# Altium schematic sheet Sheet1.SchDoc
size A4; SheetNumber: 1; SheetTotal: 1
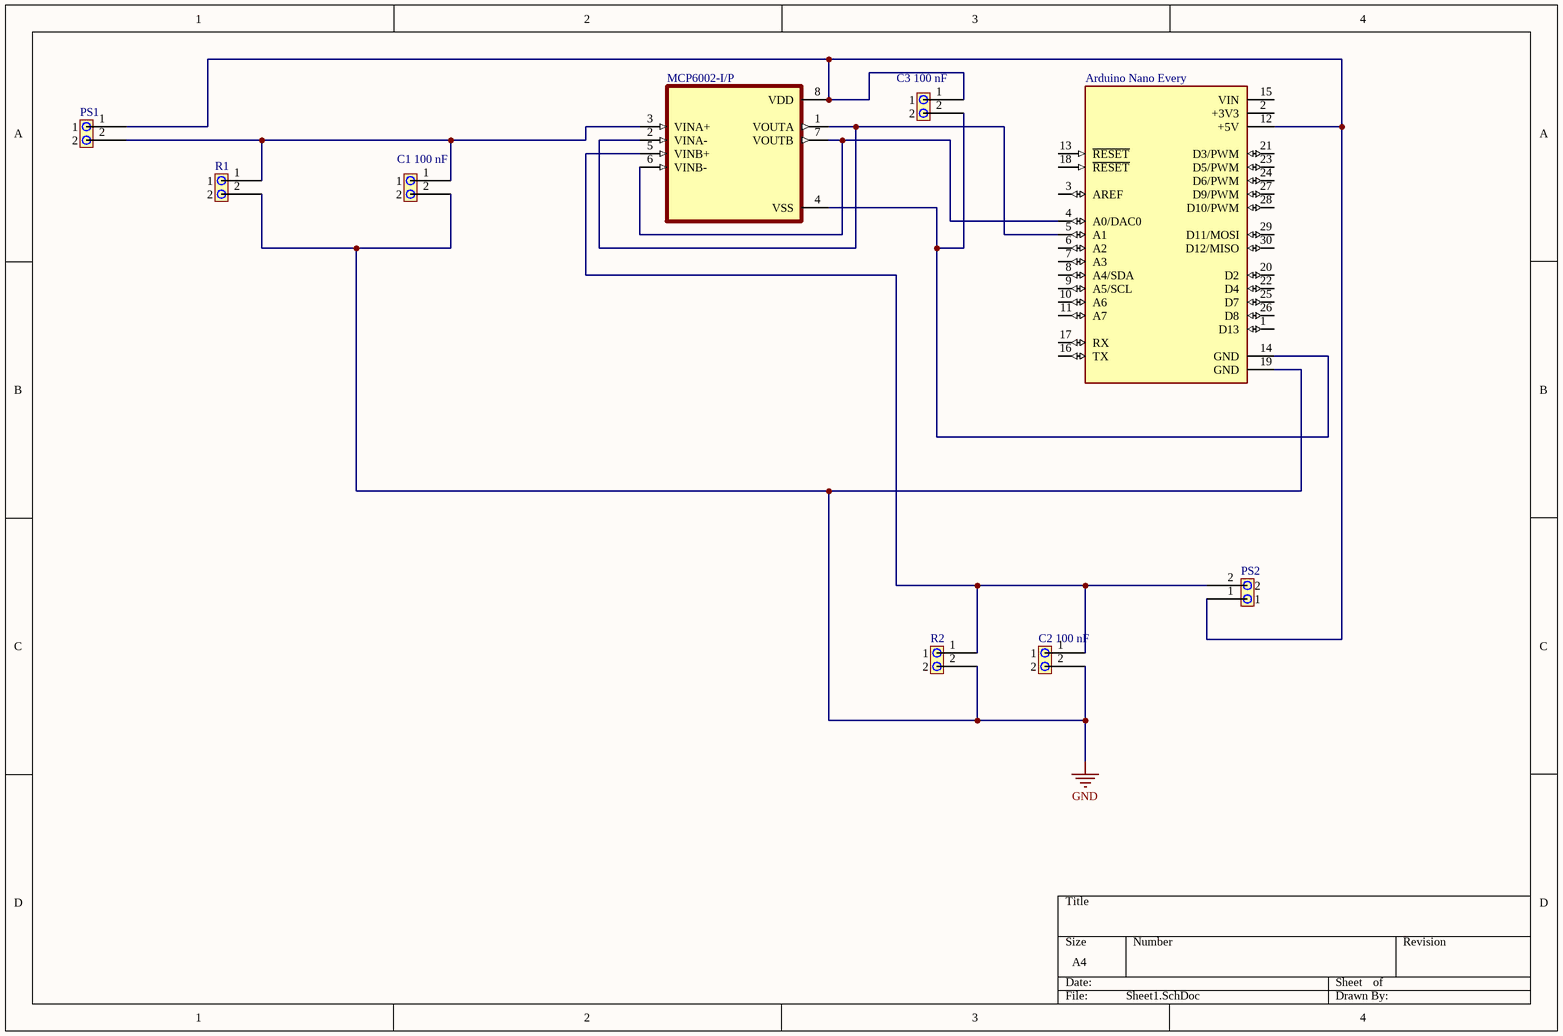
[diagram p0: Sheet1.SchDoc]

## Parts
Arduino_Nano_Every  ABX00028  [MODULE_ABX00028]  (value not drawn)
C1_100_nF  2 p female connector strainght 2.54 mm  [2 p female connector strainght  2.54 mm]  (value not drawn)
C2_100_nF  2 p female connector strainght 2.54 mm  [2 p female connector strainght  2.54 mm]  (value not drawn)
C3_100_nF  2 p female connector strainght 2.54 mm  [2 p female connector strainght  2.54 mm]  (value not drawn)
MCP6002-I/P  MCP6002-I/P  [DIP787W46P254L927H533Q8]  (value not drawn)
PS1  2 p female connector strainght 2.54 mm  [2 p female connector strainght  2.54 mm]  (value not drawn)
PS2  2 p female connector strainght 2.54 mm  [2 p female connector strainght  2.54 mm]  (value not drawn)
R1  2 p female connector strainght 2.54 mm  [2 p female connector strainght  2.54 mm]  (value not drawn)
R2  2 p female connector strainght 2.54 mm  [2 p female connector strainght  2.54 mm]  (value not drawn)

## Nets
GND: Arduino_Nano_Every.19(GND) C1_100_nF.2 C2_100_nF.2 R1.2 R2.2
NetArduino_Nano_Every_4: Arduino_Nano_Every.4(A0/DAC0) MCP6002-I/P.6(VINB-) MCP6002-I/P.7(VOUTB)
NetArduino_Nano_Every_5: Arduino_Nano_Every.5(A1) MCP6002-I/P.1(VOUTA) MCP6002-I/P.2(VINA-)
NetArduino_Nano_Every_12: Arduino_Nano_Every.12(+5V) C3_100_nF.1 MCP6002-I/P.8(VDD) PS1.1 PS2.1
NetArduino_Nano_Every_14: Arduino_Nano_Every.14(GND) C3_100_nF.2 MCP6002-I/P.4(VSS)
NetC1_100_nF_1: C1_100_nF.1 MCP6002-I/P.3(VINA+) PS1.2 R1.1
NetC2_100_nF_1: C2_100_nF.1 MCP6002-I/P.5(VINB+) PS2.2 R2.1

Not connected (* = marked no-connect by the designer): Arduino_Nano_Every 1(D13) 2(+3V3) 3(AREF) 6(A2) 7(A3) 8(A4/SDA) 9(A5/SCL) 10(A6) 11(A7) 13(~{RESET}) 15(VIN) 16(TX) 17(RX) 18(~{RESET}) 20(D2) 21(D3/PWM) 22(D4) 23(D5/PWM) 24(D6/PWM) 25(D7) 26(D8) 27(D9/PWM) 28(D10/PWM) 29(D11/MOSI) 30(D12/MISO)

## Library data of the parts
Arduino_Nano_Every = CMP-039-000001-1: Arduinoâ€™s 5V compatible board in the smallest available form factor: 45x18mm!; MP: Arduino Nano Every; Check_prices: https://www.snapeda.com/parts/Arduino%20Nano%20Every/Arduino/view-part/?ref=eda; SnapEDA_Link: https://www.snapeda.com/parts/Arduino%20Nano%20Every/Arduino/view-part/?ref=snap; MF: Arduino; Value: *; Component Type: Standard; Source: ABX00028.SchLib; Availability: Not in stock; Design Item ID: ABX00028; Price: None; Pin Count: 30; Package: None
MCP6002-I/P = CMP-014-00003-1: General Purpose Amplifier 2 Circuit Rail-to-Rail 8-PDIP; MF: Microchip; Case/Package: DIP-8 Microchip; Availability: Unavailable; Price: None; SnapEDA_Link: https://www.snapeda.com/parts/MCP6002-I/P/Microchip/view-part/235723/?ref=snap; MP: MCP6002-I/P; Value: *; Component Type: Standard; Design Item ID: MCP6002-I/P; Source: SnapEDAsch.SchLib; Pins: 8